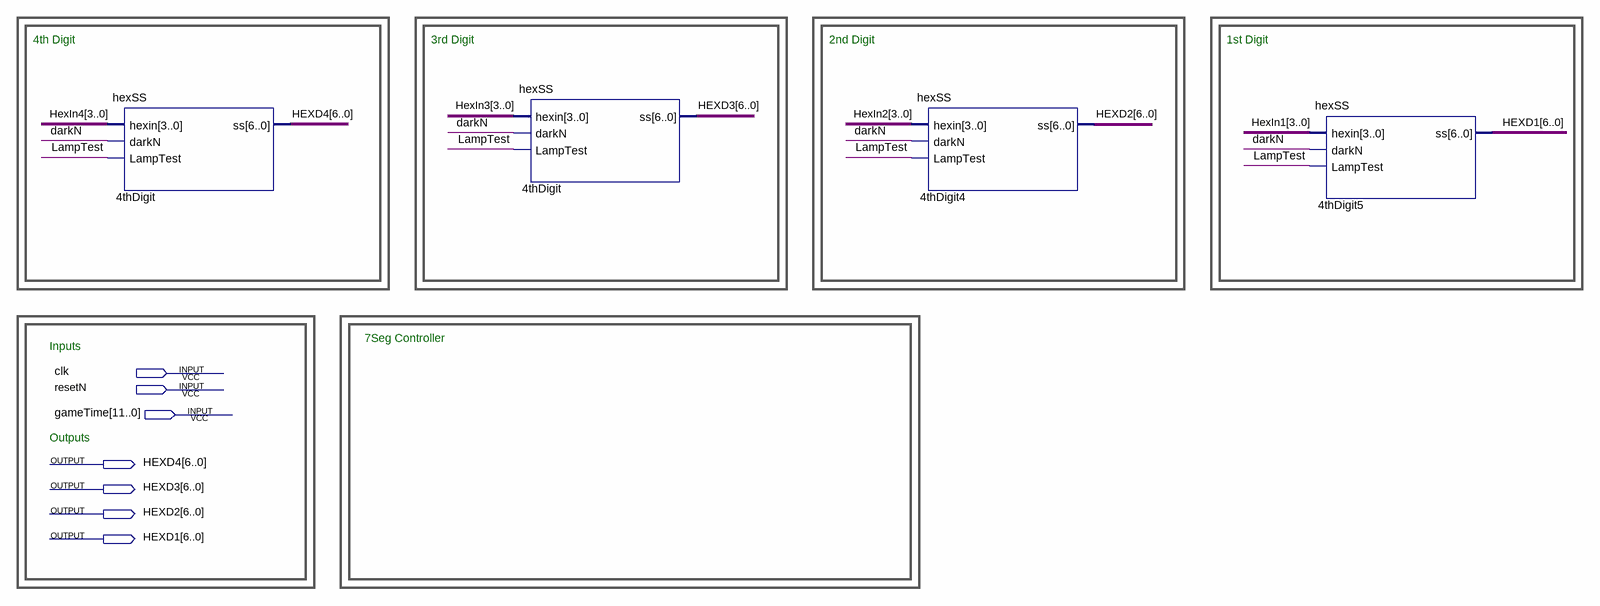
[diagram p0: schematic sheet]
// Quartus schematic Lab1Demo.bdf as structural Verilog: 4 symbols, 7 pins
module Lab1Demo (
  input  clk,
  input  resetN,
  input  [11:0] gameTime,
  output [6:0] HEXD4,
  output [6:0] HEXD3,
  output [6:0] HEXD2,
  output [6:0] HEXD1
);

  wire darkN, LampTest;
  wire [3:0] HexIn1, HexIn2, HexIn3, HexIn4;

  hexSS u_4thDigit (.hexin(HexIn4), .darkN(darkN), .LampTest(LampTest), .ss(HEXD4));
  hexSS u_4thDigit_dup2 (.hexin(HexIn3), .darkN(darkN), .LampTest(LampTest), .ss(HEXD3));
  hexSS u_4thDigit4 (.hexin(HexIn2), .darkN(darkN), .LampTest(LampTest), .ss(HEXD2));
  hexSS u_4thDigit5 (.hexin(HexIn1), .darkN(darkN), .LampTest(LampTest), .ss(HEXD1));

  // Notes on the sheet:
  //   4th Digit
  //   3rd Digit
  //   2nd Digit
  //   1st Digit
  //   7Seg Controller
  //   Inputs
  //   Outputs
endmodule
